# Altium schematic sheet ShuntAmp.SchDoc
size A4; SheetNumber: 10; SheetTotal: 21
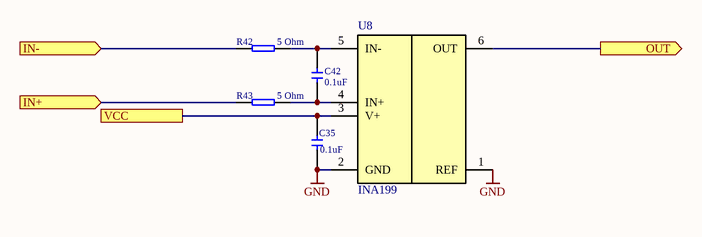
[diagram p0: ShuntAmp.SchDoc]

## Parts
C35  value 0.1uF  [CERCAP 0402]
C42  value 0.1uF  [CERCAP 0402]
R42  value 5 Ohm  [RES 0402]
R43  value 5 Ohm  [RES 0402]
U8  INA199  [SOT-323-6 (SC-70)]

## Ports
IN+ (in), IN- (in), OUT (out), VCC

## Nets
GND: C35.1 U8.1(REF) U8.2(GND)
IN+: R43.1 ; port IN+
IN-: R42.1 ; port IN-
OUT: U8.6(OUT) ; port OUT
VCC: C35.2 U8.3(V+) ; port VCC
NetC42_1: C42.1 R43.2 U8.4(IN+)
NetC42_2: C42.2 R42.2 U8.5(IN-)

## Library data of the parts
C35 C42 = !Capacitor: Capacitor; IsSMT: NoSMT; Voltage: 50V; Diel: X7R
R42 R43 = !Resistor: Resistor; IsSMT: NoSMT
U8 = INA199: Current shunt monitor; IsSMT: NoSMT